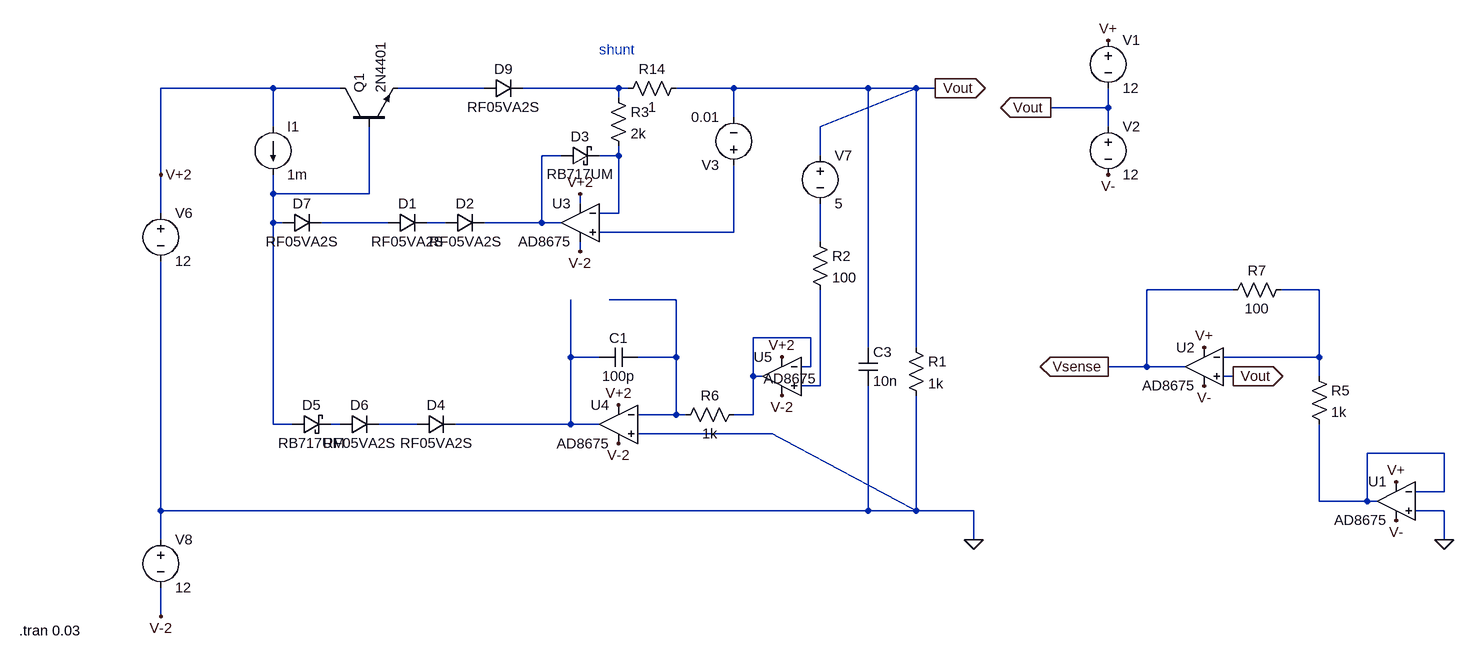
[diagram p0: schematic no_cc_floating_ref_sensing problem.asc]
no_cc_floating_ref_sensing problem.asc, the LTspice schematic file:
Version 4
SHEET 1 3784 1300
WIRE 1616 -16 1424 -16
WIRE 1728 -16 1616 -16
WIRE 1968 -16 1824 -16
WIRE 2192 -16 2032 -16
WIRE 2208 -16 2192 -16
WIRE 2384 -16 2288 -16
WIRE 2608 -16 2384 -16
WIRE 2688 -16 2608 -16
WIRE 2720 -16 2688 -16
WIRE 2192 0 2192 -16
WIRE 3008 16 3008 -16
WIRE 3008 16 2912 16
WIRE 2384 32 2384 -16
WIRE 1616 48 1616 -16
WIRE 2528 48 2688 -16
WIRE 3008 48 3008 16
WIRE 2096 96 2064 96
WIRE 2192 96 2192 80
WIRE 2192 96 2160 96
WIRE 2528 96 2528 48
WIRE 1424 128 1424 -16
WIRE 1616 160 1616 128
WIRE 1776 160 1776 48
WIRE 1776 160 1616 160
WIRE 2128 176 2128 160
WIRE 1424 192 1424 128
WIRE 2192 192 2192 96
WIRE 2192 192 2160 192
WIRE 1616 208 1616 160
WIRE 1632 208 1616 208
WIRE 1808 208 1696 208
WIRE 1904 208 1872 208
WIRE 2064 208 2064 96
WIRE 2064 208 1968 208
WIRE 2096 208 2064 208
WIRE 2384 224 2384 112
WIRE 2384 224 2160 224
WIRE 2528 240 2528 176
WIRE 2128 256 2128 240
WIRE 3216 320 3072 320
WIRE 3360 320 3296 320
WIRE 2288 336 2176 336
WIRE 2512 400 2416 400
WIRE 2608 416 2608 -16
WIRE 2688 416 2688 -16
WIRE 2112 432 2112 336
WIRE 2160 432 2112 432
WIRE 2288 432 2288 336
WIRE 2288 432 2224 432
WIRE 3360 432 3360 320
WIRE 3360 432 3200 432
WIRE 2512 448 2512 400
WIRE 2512 448 2496 448
WIRE 3072 448 3072 320
WIRE 3072 448 3008 448
WIRE 3136 448 3072 448
WIRE 2416 464 2416 400
WIRE 2432 464 2416 464
WIRE 3216 464 3200 464
WIRE 3360 464 3360 432
WIRE 2528 480 2528 320
WIRE 2528 480 2496 480
WIRE 2288 528 2288 432
WIRE 2288 528 2224 528
WIRE 2304 528 2288 528
WIRE 2416 528 2416 464
WIRE 2416 528 2384 528
WIRE 1616 544 1616 208
WIRE 1648 544 1616 544
WIRE 1728 544 1712 544
WIRE 1856 544 1792 544
WIRE 2112 544 2112 432
WIRE 2112 544 1920 544
WIRE 2160 544 2112 544
WIRE 2448 560 2224 560
WIRE 3568 592 3440 592
WIRE 3568 656 3568 592
WIRE 3568 656 3520 656
WIRE 3360 672 3360 544
WIRE 3440 672 3440 592
WIRE 3440 672 3360 672
WIRE 3456 672 3440 672
WIRE 1424 688 1424 272
WIRE 2608 688 2608 480
WIRE 2608 688 1424 688
WIRE 2688 688 2688 496
WIRE 2688 688 2448 560
WIRE 2688 688 2608 688
WIRE 2784 688 2688 688
WIRE 3568 688 3520 688
WIRE 1424 736 1424 688
WIRE 2784 736 2784 688
WIRE 3568 736 3568 688
WIRE 1424 864 1424 816
FLAG 1424 864 V-2
FLAG 1424 128 V+2
FLAG 2192 512 V+2
FLAG 2192 576 V-2
FLAG 2784 736 0
FLAG 2720 -16 Vout
IOPIN 2720 -16 Out
FLAG 3008 -96 V+
FLAG 3008 128 V-
FLAG 3168 416 V+
FLAG 3168 480 V-
FLAG 2912 16 Vout
IOPIN 2912 16 Out
FLAG 3008 448 Vsense
IOPIN 3008 448 Out
FLAG 3216 464 Vout
IOPIN 3216 464 Out
FLAG 3488 640 V+
FLAG 3488 704 V-
FLAG 3568 736 0
FLAG 2128 160 V+2
FLAG 2128 256 V-2
FLAG 2464 432 V+2
FLAG 2464 496 V-2
SYMBOL voltage 1424 176 R0
WINDOW 123 0 0 Left 0
WINDOW 39 0 0 Left 0
SYMATTR InstName V6
SYMATTR Value 12
SYMBOL voltage 2528 80 R0
WINDOW 123 0 0 Left 0
WINDOW 39 0 0 Left 0
SYMATTR InstName V7
SYMATTR Value 5
SYMBOL res 2192 0 R270
WINDOW 0 32 56 VTop 2
WINDOW 3 0 56 VBottom 2
SYMATTR InstName R14
SYMATTR Value 1
SYMBOL Opamps\\AD8675 2192 480 M0
SYMATTR InstName U4
SYMBOL res 2672 400 R0
SYMATTR InstName R1
SYMATTR Value 1k
SYMBOL npn 1728 48 R270
SYMATTR InstName Q1
SYMATTR Value 2N4401
SYMBOL current 1616 48 R0
WINDOW 123 0 0 Left 0
WINDOW 39 0 0 Left 0
SYMATTR InstName I1
SYMATTR Value 1m
SYMBOL cap 2224 416 R90
WINDOW 0 0 32 VBottom 2
WINDOW 3 32 32 VTop 2
SYMATTR InstName C1
SYMATTR Value 100p
SYMBOL cap 2592 416 R0
SYMATTR InstName C3
SYMATTR Value 10n
SYMBOL voltage 1424 720 R0
WINDOW 123 0 0 Left 0
WINDOW 39 0 0 Left 0
SYMATTR InstName V8
SYMATTR Value 12
SYMBOL voltage 3008 -112 R0
WINDOW 123 0 0 Left 0
WINDOW 39 0 0 Left 0
SYMATTR InstName V1
SYMATTR Value 12
SYMBOL voltage 3008 32 R0
WINDOW 123 0 0 Left 0
WINDOW 39 0 0 Left 0
SYMATTR InstName V2
SYMATTR Value 12
SYMBOL Opamps\\AD8675 3168 384 M0
SYMATTR InstName U2
SYMBOL res 3344 448 R0
SYMATTR InstName R5
SYMATTR Value 1k
SYMBOL res 3312 304 R90
WINDOW 0 0 56 VBottom 2
WINDOW 3 32 56 VTop 2
SYMATTR InstName R7
SYMATTR Value 100
SYMBOL Opamps\\AD8675 3488 608 M0
SYMATTR InstName U1
SYMBOL res 2512 224 R0
SYMATTR InstName R2
SYMATTR Value 100
SYMBOL Opamps\\AD8675 2128 144 M0
SYMATTR InstName U3
SYMBOL voltage 2384 128 R180
WINDOW 123 0 0 Left 0
WINDOW 39 0 0 Left 0
SYMATTR InstName V3
SYMATTR Value 0.01
SYMBOL schottky 2096 112 R270
WINDOW 0 32 32 VTop 2
WINDOW 3 0 32 VBottom 2
SYMATTR InstName D3
SYMATTR Value RB717UM
SYMATTR Description Diode
SYMATTR Type diode
SYMBOL res 2176 -16 R0
SYMATTR InstName R3
SYMATTR Value 2k
SYMBOL schottky 1648 560 R270
WINDOW 0 32 32 VTop 2
WINDOW 3 0 32 VBottom 2
SYMATTR InstName D5
SYMATTR Value RB717UM
SYMATTR Description Diode
SYMATTR Type diode
SYMBOL Opamps\\AD8675 2464 400 M0
WINDOW 3 -57 68 Left 2
SYMATTR InstName U5
SYMBOL res 2400 512 R90
WINDOW 0 0 56 VBottom 2
WINDOW 3 32 56 VTop 2
SYMATTR InstName R6
SYMATTR Value 1k
SYMBOL diode 1968 0 R270
WINDOW 0 32 32 VTop 2
WINDOW 3 0 32 VBottom 2
SYMATTR InstName D9
SYMATTR Value RF05VA2S
SYMBOL diode 1856 560 R270
WINDOW 0 32 32 VTop 2
WINDOW 3 0 32 VBottom 2
SYMATTR InstName D4
SYMATTR Value RF05VA2S
SYMBOL diode 1728 560 R270
WINDOW 0 32 32 VTop 2
WINDOW 3 0 32 VBottom 2
SYMATTR InstName D6
SYMATTR Value RF05VA2S
SYMBOL diode 1904 224 R270
WINDOW 0 32 32 VTop 2
WINDOW 3 0 32 VBottom 2
SYMATTR InstName D2
SYMATTR Value RF05VA2S
SYMBOL diode 1808 224 R270
WINDOW 0 32 32 VTop 2
WINDOW 3 0 32 VBottom 2
SYMATTR InstName D1
SYMATTR Value RF05VA2S
SYMBOL diode 1632 224 R270
WINDOW 0 32 32 VTop 2
WINDOW 3 0 32 VBottom 2
SYMATTR InstName D7
SYMATTR Value RF05VA2S
TEXT -552 888 Left 2 !.tran 0.03
TEXT 2160 -80 Left 2 ;shunt

The netlist it stands for:
* no_cc_floating_ref_sensing problem.asc
V6 V+2 0 12
V7 Vout N009 5
R14 N002 Vout 1
XU4 0 N011 V+2 V-2 N013 AD8675  ; pins In+ In- V+ V- OUT
R1 Vout 0 1k
Q1 V+2 N005 N001 0 2N4401
I1 V+2 N005 1m
C1 N011 N013 100p
C3 Vout 0 10n
V8 0 V-2 12
V1 V+ Vout 12
V2 Vout V- 12
XU2 Vout N010 V+ V- Vsense AD8675  ; pins In+ In- V+ V- OUT
R5 N010 N017 1k
R7 N010 Vsense 100
XU1 0 N017 V+ V- N017 AD8675  ; pins In+ In- V+ V- OUT
R2 N009 N014 100
XU3 N008 N004 V+2 V-2 N003 AD8675  ; pins In+ In- V+ V- OUT
V3 N008 Vout 0.01
D3 N003 N004 RB717UM
R3 N002 N004 2k
D5 N005 N015 RB717UM
XU5 N014 N012 V+2 V-2 N012 AD8675  ; pins In+ In- V+ V- OUT
R6 N012 N011 1k
D9 N001 N002 RF05VA2S
D4 N016 N013 RF05VA2S
D6 N015 N016 RF05VA2S
D2 N007 N003 RF05VA2S
D1 N006 N007 RF05VA2S
D7 N005 N006 RF05VA2S
.model D D
.lib standard.dio
.model NPN NPN
.model PNP PNP
.lib standard.bjt
.tran 0.03
* shunt
.backanno
.end